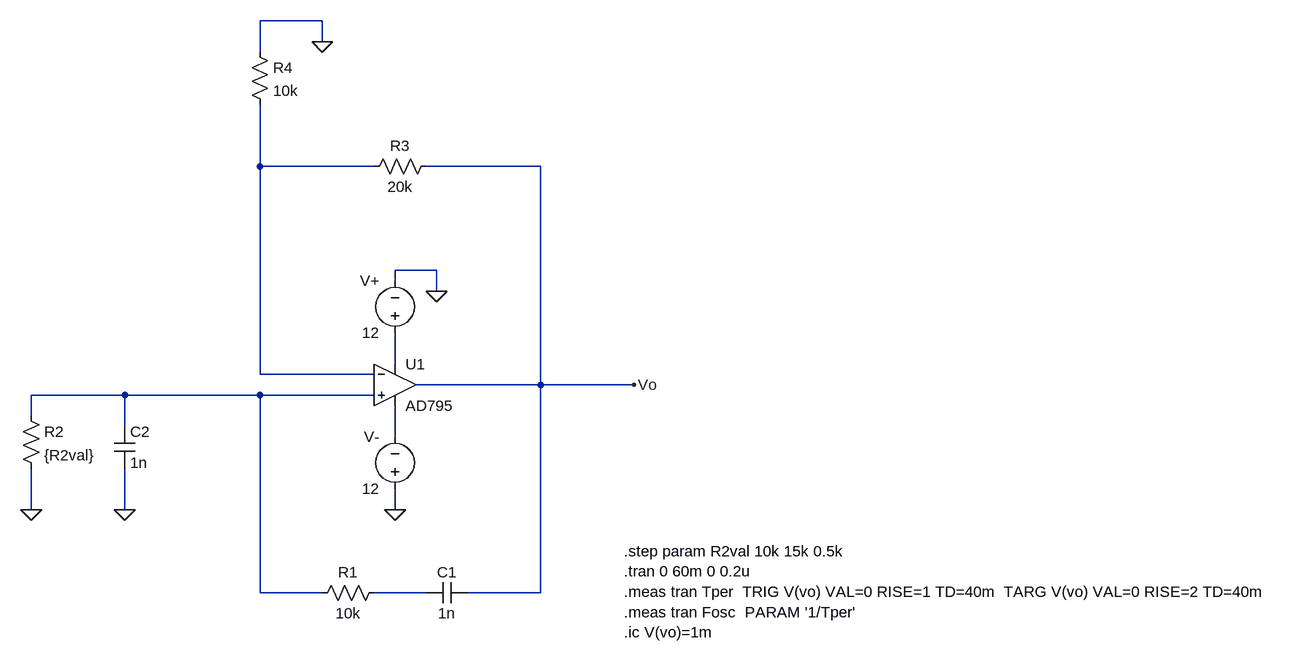
[diagram p0: schematic HW1_Q1.asc]
HW1_Q1.asc, the LTspice schematic file:
Version 4
SHEET 1 1644 680
WIRE 128 -384 32 -384
WIRE 128 -352 128 -384
WIRE 32 -336 32 -384
WIRE 32 -160 32 -256
WIRE 208 -160 32 -160
WIRE 464 -160 288 -160
WIRE 304 0 240 0
WIRE 240 16 240 0
WIRE 304 32 304 0
WIRE 240 144 240 96
WIRE 32 160 32 -160
WIRE 208 160 32 160
WIRE 464 176 464 -160
WIRE 464 176 272 176
WIRE 608 176 464 176
WIRE -176 192 -320 192
WIRE 32 192 -176 192
WIRE 208 192 32 192
WIRE -320 224 -320 192
WIRE -176 240 -176 192
WIRE 240 256 240 208
WIRE -320 368 -320 304
WIRE -176 368 -176 304
WIRE 240 368 240 336
WIRE 32 496 32 192
WIRE 128 496 32 496
WIRE 288 496 208 496
WIRE 464 496 464 176
WIRE 464 496 352 496
FLAG 240 368 0
FLAG 304 32 0
FLAG -320 368 0
FLAG -176 368 0
FLAG 128 -352 0
FLAG 608 176 Vo
SYMBOL OpAmps\\AD795 240 112 R0
SYMATTR InstName U1
SYMBOL voltage 240 112 R180
WINDOW 0 24 96 Left 2
WINDOW 3 24 16 Left 2
SYMATTR InstName V+
SYMATTR Value 12
SYMBOL voltage 240 352 R180
WINDOW 0 24 96 Left 2
WINDOW 3 24 16 Left 2
SYMATTR InstName V-
SYMATTR Value 12
SYMBOL res 112 512 R270
WINDOW 0 32 56 VTop 2
WINDOW 3 0 56 VBottom 2
SYMATTR InstName R1
SYMATTR Value 10k
SYMBOL res -336 208 R0
SYMATTR InstName R2
SYMATTR Value {R2val}
SYMBOL cap 352 480 R90
WINDOW 0 0 32 VBottom 2
WINDOW 3 32 32 VTop 2
SYMATTR InstName C1
SYMATTR Value 1n
SYMBOL cap -192 240 R0
SYMATTR InstName C2
SYMATTR Value 1n
SYMBOL res 304 -176 R90
WINDOW 0 0 56 VBottom 2
WINDOW 3 32 56 VTop 2
SYMATTR InstName R3
SYMATTR Value 20k
SYMBOL res 16 -352 R0
SYMATTR InstName R4
SYMATTR Value 10k
TEXT 592 432 Left 2 !.step param R2val 10k 15k 0.5k\n.tran 0 60m 0 0.2u\n.meas tran Tper  TRIG V(vo) VAL=0 RISE=1 TD=40m  TARG V(vo) VAL=0 RISE=2 TD=40m\n.meas tran Fosc  PARAM '1/Tper'\n.ic V(vo)=1m

The netlist it stands for:
* HW1_Q1.asc
XU1 N003 N001 N002 N004 Vo AD795  ; pins In+ In- V+ V- OUT
V+ N002 0 12
V- 0 N004 12
R1 N003 N005 10k
R2 N003 0 {R2val}
C1 Vo N005 1n
C2 N003 0 1n
R3 Vo N001 20k
R4 0 N001 10k
.step param R2val 10k 15k 0.5k
.tran 0 60m 0 0.2u
.meas tran Tper  TRIG V(vo) VAL=0 RISE=1 TD=40m  TARG V(vo) VAL=0 RISE=2 TD=40m
.meas tran Fosc  PARAM '1/Tper'
.ic V(vo)=1m
.lib ADI1.lib
.backanno
.end